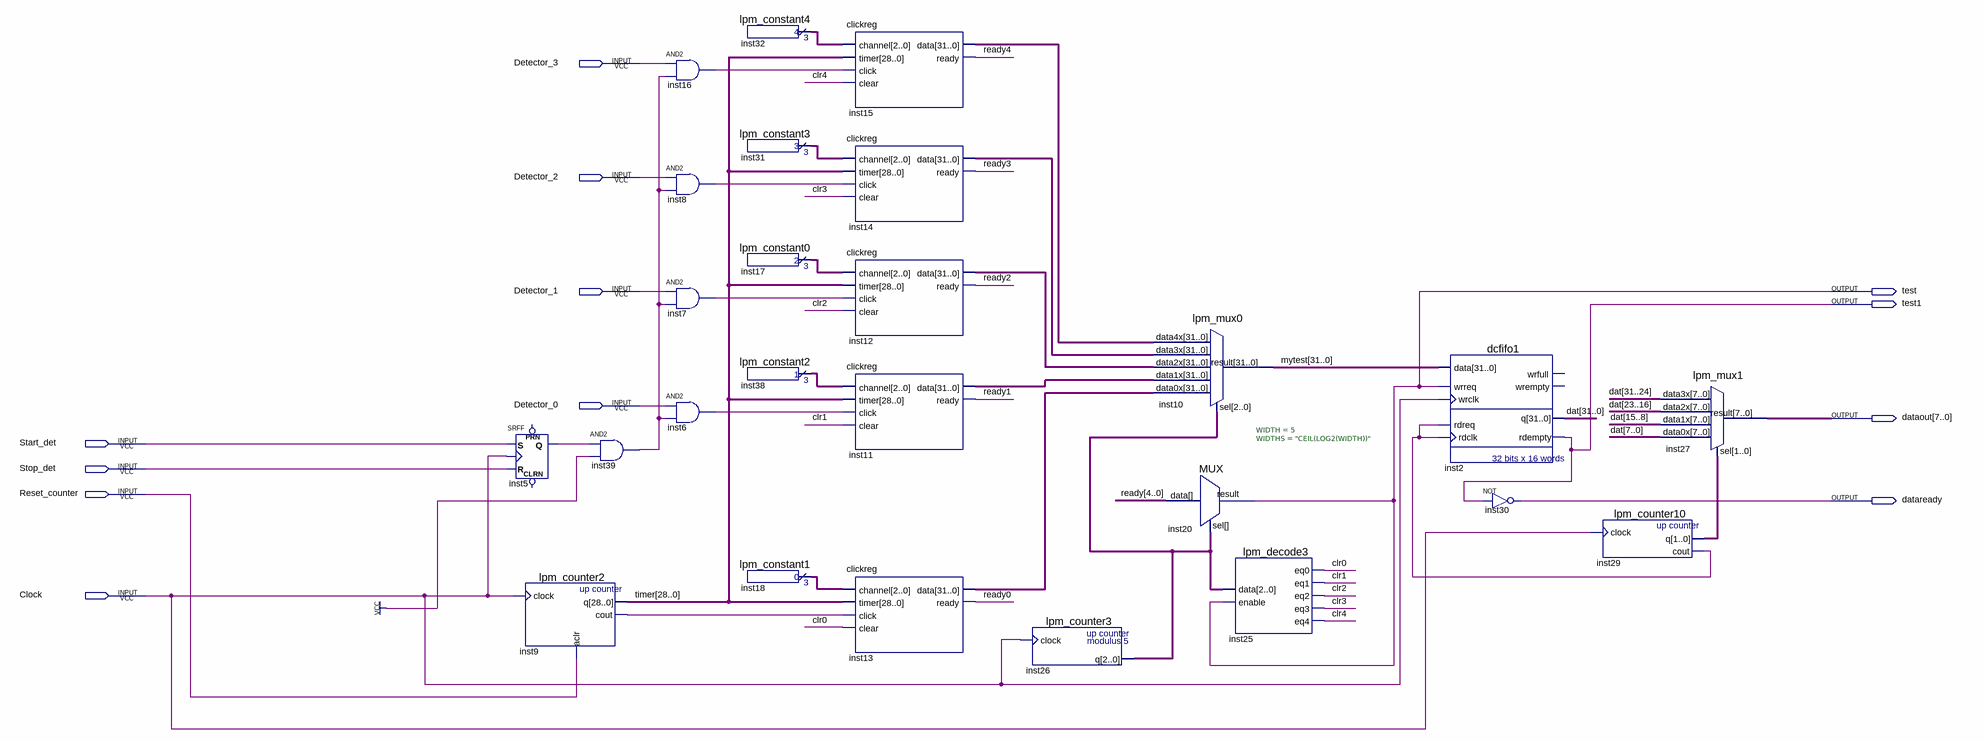
[diagram p0: schematic sheet]
// Quartus schematic apdtimer.bdf as structural Verilog: 25 symbols, 12 pins
module apdtimer (
  input  Detector_3,
  input  Detector_2,
  input  Detector_1,
  input  Detector_0,
  input  Start_det,
  input  Stop_det,
  input  Reset_counter,
  input  Clock,
  output test,
  output test1,
  output [7:0] dataout,
  output dataready
);

  wire clr0, clr1, clr2, clr3, clr4, inst5_q, inst6_out, inst7_out, inst8_out, inst9_cout, inst16_out,
       inst29_cout, inst39_out;
  wire [1:0] inst29_q;
  wire [2:0] inst17_result, inst18_result, inst26_q, inst31_result, inst32_result, inst38_result;
  wire [4:0] ready;
  wire [28:0] timer;
  wire [31:0] dat, inst11_data, inst12_data, inst13_data, inst14_data, inst15_data, mytest;

  SRFF inst5 (.S(Start_det), .R(Stop_det), .CLK(Clock), .Q(inst5_q));  // open: PRN, CLRN
  lpm_counter2 inst9 (.clock(Clock), .aclr(Reset_counter), .q(timer), .cout(inst9_cout));
  and inst39 (inst39_out, inst5_q, 1'b1);
  and inst16 (inst16_out, Detector_3, inst39_out);
  and inst8 (inst8_out, Detector_2, inst39_out);
  and inst7 (inst7_out, Detector_1, inst39_out);
  and inst6 (inst6_out, Detector_0, inst39_out);
  lpm_constant4 inst32 (.result(inst32_result));
  lpm_constant3 inst31 (.result(inst31_result));
  lpm_constant0 inst17 (.result(inst17_result));
  lpm_constant2 inst38 (.result(inst38_result));
  lpm_constant1 inst18 (.result(inst18_result));
  clickreg inst15 (
    .channel(inst32_result), .timer(timer), .click(inst16_out), .clear(clr4), .data(inst15_data),
    .ready(ready[4]));
  clickreg inst14 (
    .channel(inst31_result), .timer(timer), .click(inst8_out), .clear(clr3), .data(inst14_data),
    .ready(ready[3]));
  clickreg inst12 (
    .channel(inst17_result), .timer(timer), .click(inst7_out), .clear(clr2), .data(inst12_data),
    .ready(ready[2]));
  clickreg inst11 (
    .channel(inst38_result), .timer(timer), .click(inst6_out), .clear(clr1), .data(inst11_data),
    .ready(ready[1]));
  clickreg inst13 (
    .channel(inst18_result), .timer(timer), .click(inst9_cout), .clear(clr0), .data(inst13_data),
    .ready(ready[0]));
  lpm_counter3 inst26 (.clock(Clock), .q(inst26_q));
  lpm_mux0 inst10 (
    .data4x(inst15_data), .data3x(inst14_data), .data2x(inst12_data), .data1x(inst11_data),
    .data0x(inst13_data), .sel(inst26_q), .result(mytest));
  MUX #(.WIDTH(5), .WIDTHS("CEIL(LOG2(WIDTH))")) inst20 (.data(ready), .sel(inst26_q), .result(test));
  lpm_decode3 inst25 (.data(inst26_q), .enable(test), .eq0(clr0), .eq1(clr1), .eq2(clr2), .eq3(clr3), .eq4(clr4));
  dcfifo1 inst2 (
    .data(mytest), .wrreq(test), .wrclk(Clock), .rdreq(inst29_cout), .rdclk(inst29_cout), .q(dat),
    .rdempty(test1));  // open: wrfull, wrempty
  not inst30 (dataready, test1);
  lpm_counter10 inst29 (.clock(Clock), .q(inst29_q), .cout(inst29_cout));
  lpm_mux1 inst27 (
    .data3x(dat[31:24]), .data2x(dat[23:16]), .data1x(dat[15:8]), .data0x(dat[7:0]), .sel(inst29_q),
    .result(dataout));
endmodule
